# EAGLE design v2.1 (EAGLE 7.2.0)
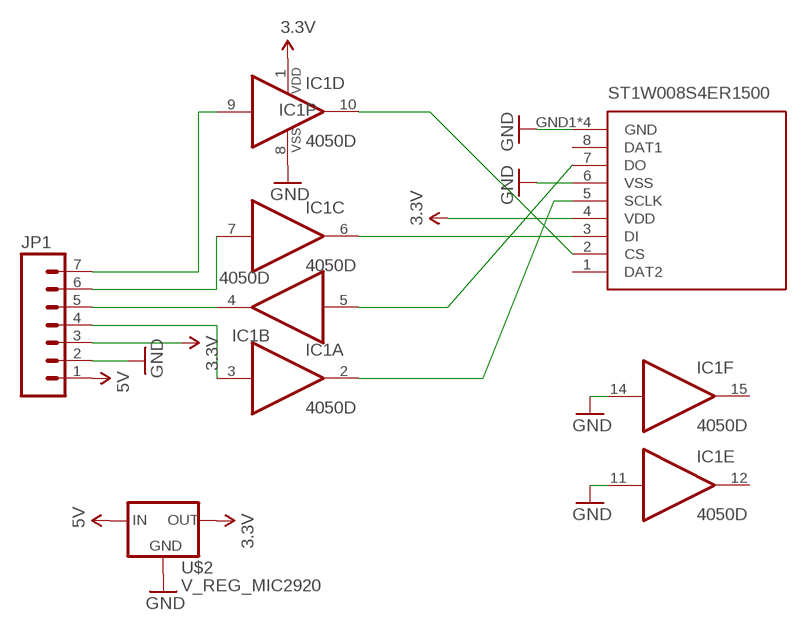
[diagram p0: schematic, sheet 1]

## Parts
IC1  4050D  [SO16]
JP1  M07  [1X07]
U$1  ST1W008S4ER1500  [ST1W008S4ER1500]
U$2  V_REG_MIC2920  [SOT223]

## Nets
3.3V: IC1.1(P:VDD) JP1.3 U$1.4(VDD) U$2.3(OUT)
5V: JP1.1 U$2.1(IN)
GND: IC1.8(P:VSS) IC1.11(E:I) IC1.14(F:I) JP1.2 U$1.6(VSS) U$1.GND1(GND) U$1.GND2(GND) U$1.GND3(GND) U$1.GND4(GND) U$2.2(GND)
N$1: IC1.9(D:I) JP1.7
N$2: IC1.7(C:I) JP1.6
N$3: IC1.5(B:I) U$1.7(DO)
N$4: IC1.3(A:I) JP1.4
N$5: IC1.10(D:O) U$1.2(CS)
N$6: IC1.6(C:O) U$1.3(DI)
N$7: IC1.4(B:O) JP1.5
N$8: IC1.2(A:O) U$1.5(SCLK)
Unconnected: IC1.12(E:O) IC1.15(F:O) U$1.1(DAT2) U$1.8(DAT1)

## Library data of the parts
IC1 = 40xx:4050: Hex non-inverting BUFFER
JP1 = SparkFun-Connectors:M07: Header 7 Standard 7-pin 0.1" header. Use with straight break away headers (SKU : PRT-00116), right angle break away headers (PRT-00553), swiss pins (PRT-00743), machine pins (PRT-00117), and female headers (PRT-00115). NOTES ON THE VARIANTS LOCK and LOCK_LONGPADS... This footprint was designed to help hold the alignment of a through-hole component (i.e. 7-pin header) while soldering it into place. You may notice that each hole has been shifted either up or down by 0.005 of an inch from it's more standard position (which is usually a perfectly straight line). This slight alteration caused the pins (the squares in the middle) to touch the edges of the holes. Because they are alternating, it causes a "brace" to hold the header in place. 0.005 has proven to be the perfect amount of "off-center" position when using our standard breakaway headers. Although looks a little odd when you look at the bare footprint, once you have a header in there, the alteration is very hard to notice. Also, if you push a header all the way into place, it is covered up entirely on the bottom side. This idea of altering the position of holes to aid alignment will be further integrated into the Sparkfun Library for other footprints. It can help hold any component with 3 or more connection pins.
U$1 = Kontakr-custom:ST1W008S4ER1500
U$2 = SparkFun-PowerIC:V_REG_MIC2920: MIC2920A (http://www.micrel.com/_PDF/mic2920.pdf) - 400mA output LDO Regulator

## Board
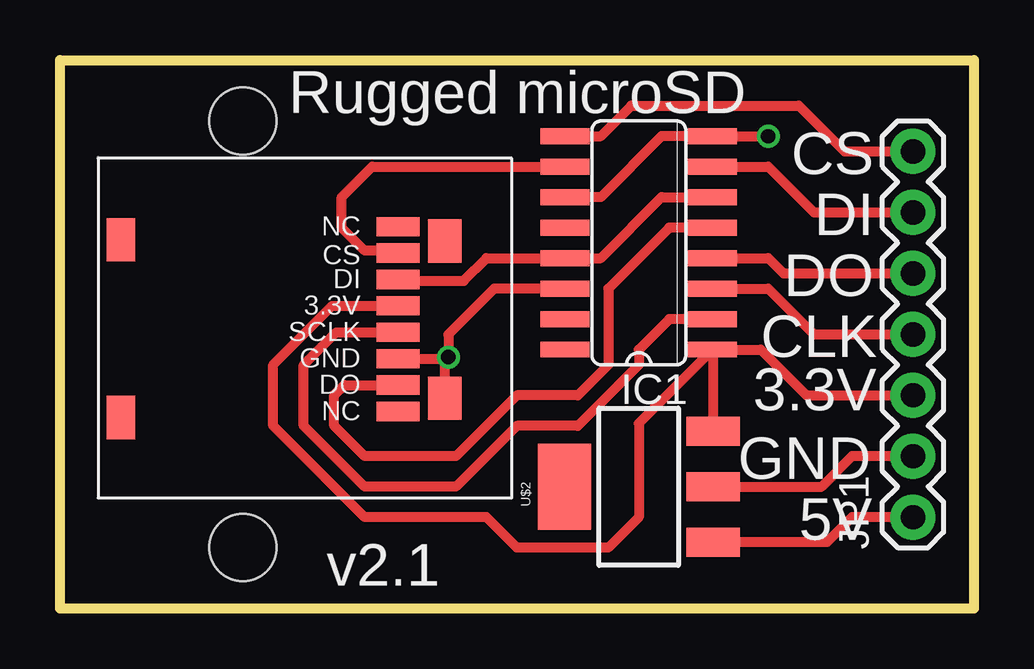
[diagram p1: board, top side]
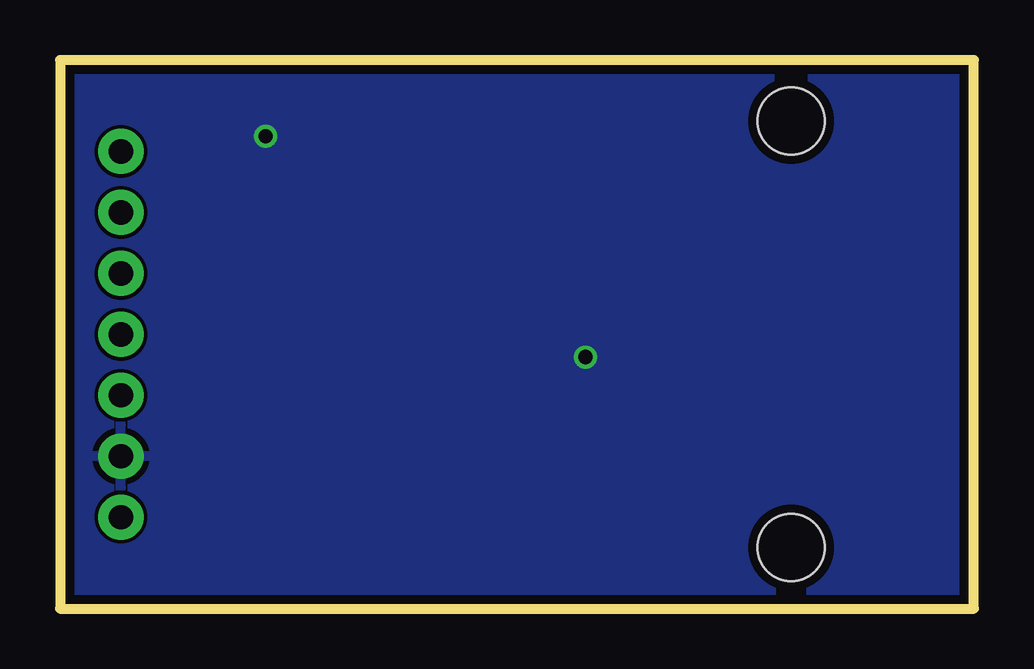
[diagram p2: board, bottom side, seen from below]

Size 38.1 x 22.86 mm. Coordinates in mm from the lower left corner, seen from the top.
Outline: 0,0 0,22.86 38.1,22.86 38.1,0 0,0
Copper layers (1*16): Top 0.0356mm / dielectric 1.5011mm / Bottom 0.0356mm
Design rules "LaenPCBOrder": minimum track width 6mil, minimum drill 13mil, track to track 6mil, track to pad 6mil, pad to pad 6mil, via to via 6mil, smd to smd 6mil, copper to edge 15mil, drill to drill 6mil, minimum pad ring 7mil, minimum via ring 7mil, stop-mask expansion 3mil, vias tented up to drill 0mil, thermal gap 10mil
Holes 2.8 mm at 7.62,20.32 7.62,2.54

### Footprints (pad centres in the part's own frame; a part is rotated, then mirrored left to right if it is on the bottom)
SO16 = smd 0.66 x 2.032: 1 -4.445,-3.073; 2 -3.175,-3.073; 3 -1.905,-3.073; 4 -0.635,-3.073; 5 0.635,-3.073; 6 1.905,-3.073; 7 3.175,-3.073; 8 4.445,-3.073; 9 4.445,3.073; 10 3.175,3.073; 11 1.905,3.073; 12 0.635,3.073; 13 -0.635,3.073; 14 -1.905,3.073; 15 -3.175,3.073; 16 -4.445,3.073
1X07 = drill 1.016 pad 1.88: 1 0,0; 2 2.54,0; 3 5.08,0; 4 7.62,0; 5 10.16,0; 6 12.7,0; 7 15.24,0
ST1W008S4ER1500 = smd 1.8 x 0.8: 1 -11.55,-3.85; 2 -11.55,-2.75; 3 -11.55,-1.65; 4 -11.55,-0.55; 5 -11.55,0.55; 6 -11.55,1.65; 7 -11.55,2.75; 8 -11.55,3.85 | smd 1.2 x 1.8: GND1 0,-3.3; GND2 0,4.1 | smd 1.4 x 1.8: GND3 -13.5,-3.25; GND4 -13.5,3.3
SOT223 = smd 1.219 x 2.235: 1 -2.311,-3.099; 2 0,-3.099; 3 2.311,-3.099 | smd 3.6 x 2.2: 4 0,3.099

### Placement (x,y rotation side)
IC1  24.13,15.24 90 top
JP1  35.56,3.81 90 top
U$1  2.54,12.07 180 top
U$2  24.13,5.08 90 top

### Tracks (layer width: path | path; a pad name or v marks a point on that pad's centre or on a via)
3.3V
  Top 0.406: IC1.1 29.21,10.79 31.11,8.89 JP1.3 | IC1.1 27.23,10.77 U$2.3 | IC1.1 24.13,7.72 24.13,3.81 22.86,2.54 19.05,2.54 17.78,3.81 12.7,3.81 8.89,7.62 8.89,10.16 11.35,12.62 U$1.4
5V
  Top 0.406: JP1.1 33.02,3.81 31.98,2.77 U$2.1
GND  (via drill 0.6)
  Top 0.406: v29.53,19.68 IC1.8 25.08,19.68 22.54,17.14 IC1.11 | JP1.2 33.02,6.35 31.75,5.08 U$2.2 | 15.56,8.93 U$1.GND4 16.04,10.33 16.13,10.42 | 14.09,10.48 U$1.6 16.13,10.42 | 16.13,10.42 v16.19,10.48 16.19,11.43 18.1,13.34 IC1.14
  pour Bottom: 0,22.86 38.1,22.86 38.1,0 0,0
N$1
  Top 0.406: IC1.9 22.54,19.68 23.81,20.96 30.8,20.96 32.7,19.05 JP1.7
N$2
  Top 0.406: IC1.7 29.53,18.41 31.43,16.51 JP1.6
N$3
  Top 0.406: IC1.5 25.4,15.88 22.86,13.34 22.86,10.16 21.59,8.89 19.05,8.89 16.51,6.35 12.7,6.35 11.43,7.62 11.43,8.89 11.86,9.32 U$1.7
N$4
  Top 0.406: IC1.3 29.53,13.34 31.43,11.43 JP1.4
N$5
  Top 0.406: U$1.2 13.98,14.92 12.7,14.92 11.75,15.88 11.75,17.14 13.02,18.41 IC1.10
N$6
  Top 0.406: U$1.3 14.15,13.65 16.83,13.65 17.78,14.61 22.54,14.61 25.08,17.14 IC1.6
N$7
  Top 0.406: IC1.4 29.53,14.61 30.16,13.97 JP1.5
N$8
  Top 0.406: IC1.2 25.4,12.07 24.13,10.79 24.13,10.16 21.59,7.62 19.05,7.62 16.51,5.08 12.7,5.08 10.16,7.62 10.16,10.16 11.52,11.52 U$1.5

### Text on the board
tPlace: Rugged microSD | CS | DI | DO | CLK | 3.3V | GND | 5V | v2.1